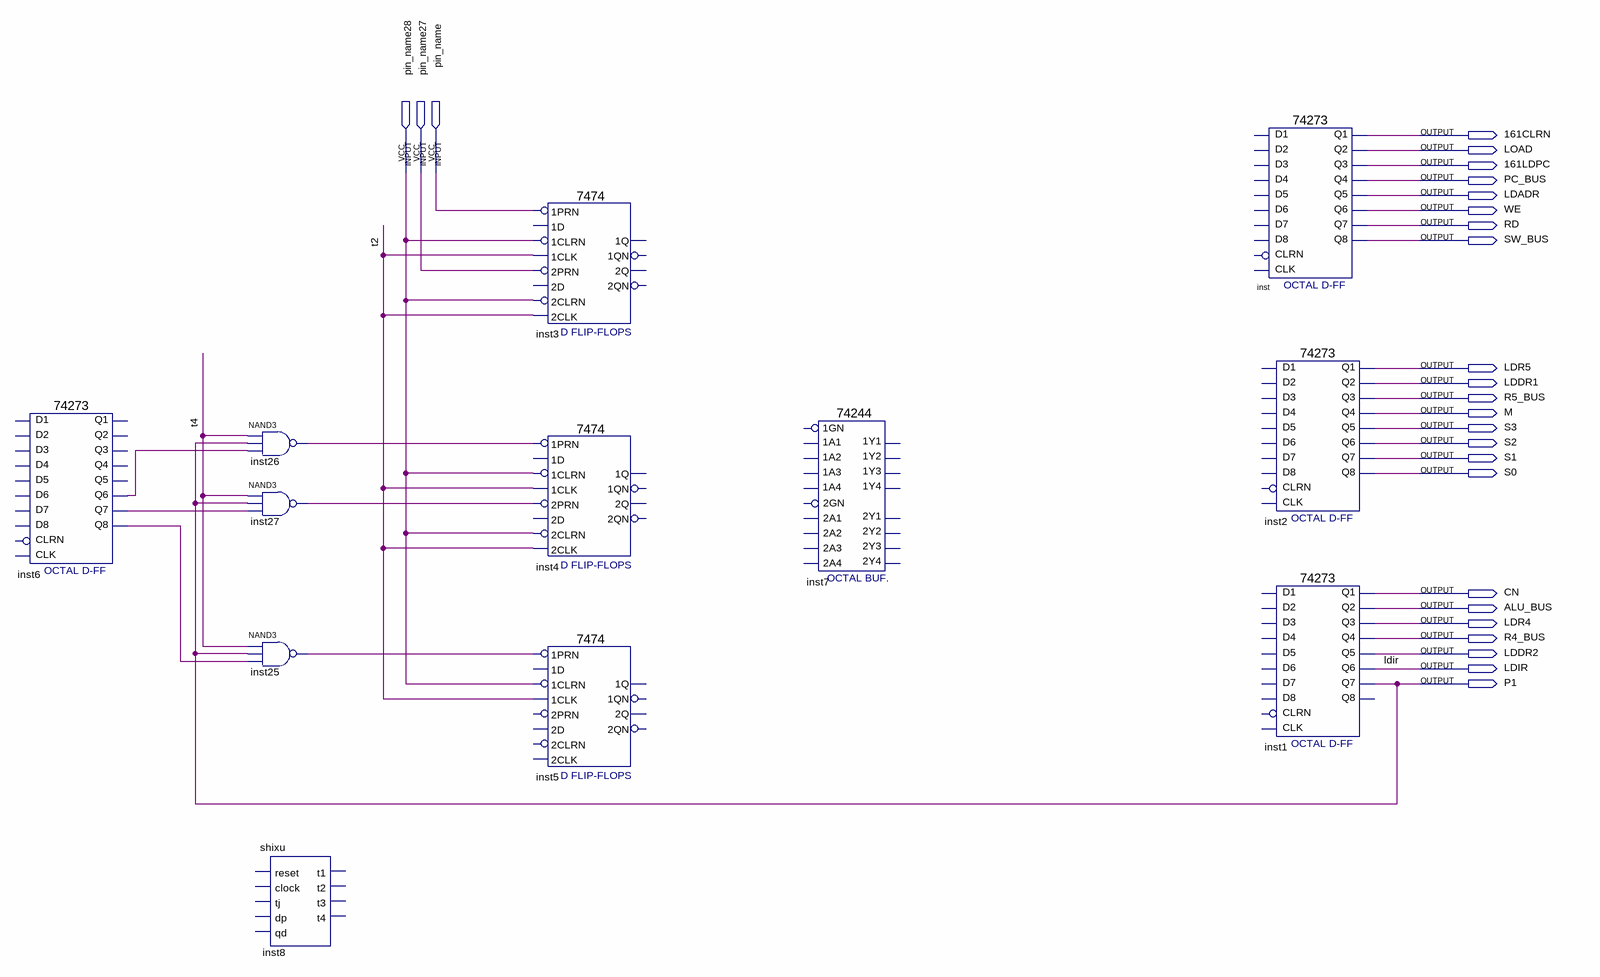
[diagram p0: schematic sheet]
// Quartus schematic mcu.bdf as structural Verilog: 12 symbols, 26 pins
module mcu (
  input  pin_name28,
  input  pin_name27,
  input  pin_name,
  output \161CLRN ,
  output LOAD,
  output \161LDPC ,
  output PC_BUS,
  output LDADR,
  output WE,
  output RD,
  output SW_BUS,
  output LDR5,
  output LDDR1,
  output R5_BUS,
  output M,
  output S3,
  output S2,
  output S1,
  output S0,
  output CN,
  output ALU_BUS,
  output LDR4,
  output R4_BUS,
  output LDDR2,
  output LDIR,
  output P1
);

  wire inst6_q6, inst6_q7, inst6_q8, inst25_out, inst26_out, inst27_out, t2, t4;

  \74273  inst6 (
    .Q6(inst6_q6), .Q7(inst6_q7), .Q8(inst6_q8));  // open: D2, D3, D1, D4, D7, D6, D5, D8, CLK, CLRN, Q4, Q1, Q2, Q3, Q5
  nand inst26 (inst26_out, t4, P1, inst6_q6);
  nand inst27 (inst27_out, t4, P1, inst6_q7);
  nand inst25 (inst25_out, t4, P1, inst6_q8);
  shixu inst8 ();  // open: reset, clock, tj, dp, qd, t1, t2, t3, t4
  \7474  inst3 (
    .\2PRN (pin_name27), .\1CLK (t2), .\1PRN (pin_name), .\2CLK (t2), .\2CLRN (pin_name28),
    .\1CLRN (pin_name28));  // open: 2D, 1D, 1QN, 2Q, 2QN, 1Q
  \7474  inst4 (
    .\2PRN (inst27_out), .\1CLK (t2), .\1PRN (inst26_out), .\2CLK (t2), .\2CLRN (pin_name28),
    .\1CLRN (pin_name28));  // open: 2D, 1D, 1QN, 2Q, 2QN, 1Q
  \7474  inst5 (
    .\1CLK (t2), .\1PRN (inst25_out), .\1CLRN (pin_name28));  // open: 2D, 2PRN, 1D, 2CLK, 2CLRN, 1QN, 2Q, 2QN, 1Q
  \74244  inst7 ();  // open: 1A2, 1A4, 1A1, 1A3, 1GN, 2A3, 2GN, 2A1, 2A4, 2A2, 1Y2, 1Y4, 2Y1, 1Y1, 2Y3, 2Y4, 1Y3, 2Y2
  \74273  inst (
    .Q4(PC_BUS), .Q1(\161CLRN ), .Q2(LOAD), .Q3(\161LDPC ), .Q6(WE), .Q5(LDADR), .Q7(RD), .Q8(SW_BUS));  // open: D2, D3, D1, D4, D7, D6, D5, D8, CLK, CLRN
  \74273  inst2 (
    .Q4(M), .Q1(LDR5), .Q2(LDDR1), .Q3(R5_BUS), .Q6(S2), .Q5(S3), .Q7(S1), .Q8(S0));  // open: D2, D3, D1, D4, D7, D6, D5, D8, CLK, CLRN
  \74273  inst1 (
    .Q4(R4_BUS), .Q1(CN), .Q2(ALU_BUS), .Q3(LDR4), .Q6(LDIR), .Q5(LDDR2), .Q7(P1));  // open: D2, D3, D1, D4, D7, D6, D5, D8, CLK, CLRN, Q8
endmodule
